# Altium schematic sheet p3_intf_conn_pwr.SchDoc
size OrCAD B; DocumentNumber: 3; SheetNumber: 3; SheetTotal: 3
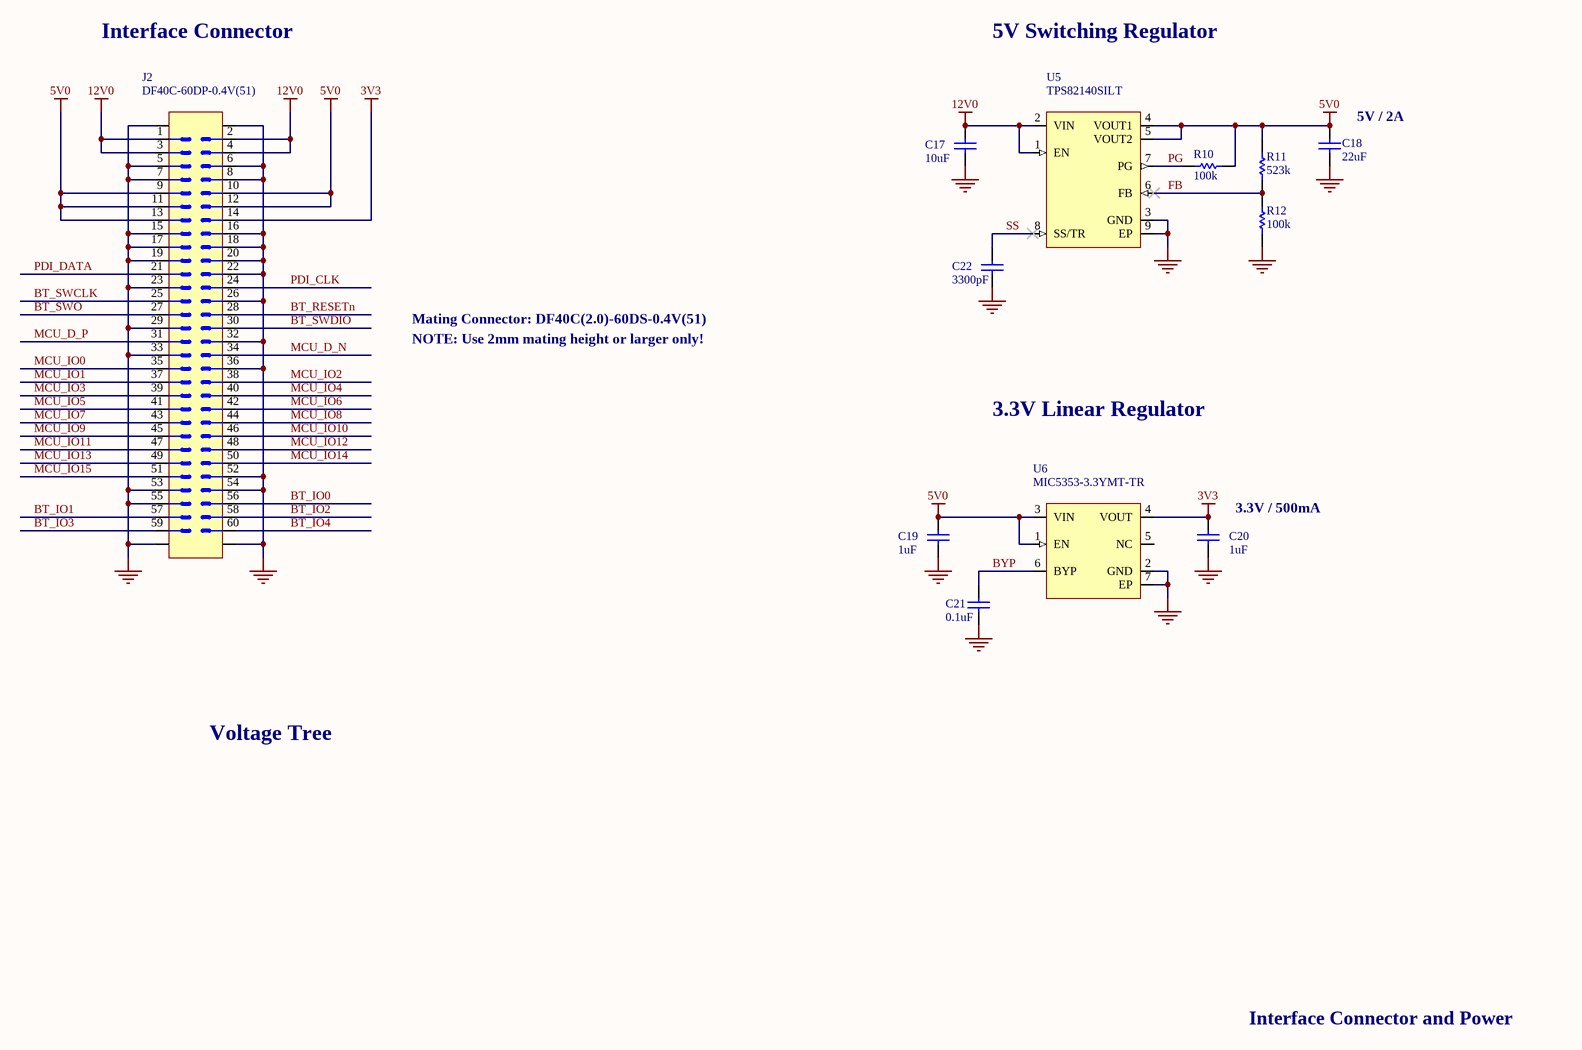
[diagram p0: p3_intf_conn_pwr.SchDoc]

## Parts
C17  10uF  [C0603]
C18  22uF  [C0603]
C19  1uF  [C0402]
C20  1uF  [C0402]
C21  0.1uF  [C0201]
C22  3300pF  [C0201]
J2  DF40C-60DP-0.4V(51)  [HRS_DF40C_60P_PLG]
R10  100k  [R0201]
R11  523k  [R0201]
R12  100k  [R0201]
U5  TPS82140SILT  [TI_USIL8_SIL0008D]
U6  MIC5353-3.3YMT-TR  [MCP_MLF6_MT]

## Nets
3V3: C20.2 J2.14 U6.4(VOUT)
5V0: C18.2 C19.2 J2.9 J2.10 J2.11 J2.12 J2.13 R10.2 R11.2 U5.4(VOUT1) U5.5(VOUT2) U6.1(EN) U6.3(VIN)
12V0: C17.2 J2.1 J2.2 J2.3 J2.4 U5.1(EN) U5.2(VIN)
GND: C17.1 C18.1 C19.1 C20.1 C21.1 C22.1 J2.5 J2.6 J2.7 J2.8 J2.15 J2.16 J2.17 J2.18 J2.19 J2.20 J2.22 J2.23 J2.26 J2.29 J2.32 J2.33 J2.36 J2.52 J2.53 J2.54 J2.55 J2.61 J2.62 J2.63 J2.64 R12.1 U5.3(GND) U5.9(EP) U6.2(GND) U6.7(EP)
BT_IO0: J2.56
BT_IO1: J2.57
BT_IO2: J2.58
BT_IO3: J2.59
BT_IO4: J2.60
BT_RESETn: J2.28
BT_SWCLK: J2.25
BT_SWDIO: J2.30
BT_SWO: J2.27
BYP: C21.2 U6.6(BYP)
FB: R11.1 R12.2 U5.6(FB)
MCU_D_N: J2.34
MCU_D_P: J2.31
MCU_IO0: J2.35
MCU_IO1: J2.37
MCU_IO2: J2.38
MCU_IO3: J2.39
MCU_IO4: J2.40
MCU_IO5: J2.41
MCU_IO6: J2.42
MCU_IO7: J2.43
MCU_IO8: J2.44
MCU_IO9: J2.45
MCU_IO10: J2.46
MCU_IO11: J2.47
MCU_IO12: J2.48
MCU_IO13: J2.49
MCU_IO14: J2.50
MCU_IO15: J2.51
PDI_CLK: J2.24
PDI_DATA: J2.21
PG: R10.1 U5.7(PG)
SS: C22.2 U5.8(SS/TR)

Not connected (* = marked no-connect by the designer): U6 5(NC)

## Notes on the sheet
- Interface Connector
- 5V Switching Regulator
- (near C18) 5V / 2A
- Mating Connector: DF40C(2.0)-60DS-0.4V(51)
- NOTE: Use 2mm mating height or larger only!
- 3.3V Linear Regulator
- (near C20) 3.3V / 500mA
- Voltage Tree
- Interface Connector and Power

## Library data of the parts
C17 = 10uF 25V 0603: CAP CER 10UF 25V X5R 0603; Manufacturer: Murata; Manufacturer Part Number: GRM188R61E106MA73D; Tolerance: 20%; Supplier 1: Digi-Key; Stock 1: 1088965; Pricing 1: 1=0.41, 10=0.285, 100=0.1708, 500=0.1281, 1000=0.1082 (USD); Mount: Surface Mount; Case/Package: 0603; Number of Pins: 2; Weight: 0.000222oz; Case Code (Metric): 1608; Case Code (Imperial): 0603; Min Operating Temperature: -55°C; Max Operating Temperature: 85°C; Voltage Rating: 25V; Capacitance: 10uF; Packaging: Tape and Reel; Package Quantity: 1; Dielectric: X5R; Voltage: 25V; Termination: SMD/SMT; Composition: Ceramic; Voltage Rating (DC): 25V; Length: 1.6mm; Height: 0.8mm; Width: 0.031inch; Thickness: 0.031inch; Depth: 0.8mm; REACH SVHC: No SVHC; Lead Free: Lead Free; ComponentLink1URL: https://datasheet.ciiva.com/22619/c02e-22619674.pdf; ComponentLink1Description: https://datasheet.ciiva.com/22619/c02e-22619674.pdf; ComponentLink2URL: https://datasheet.ciiva.com/22776/608985-22776426.pdf; ComponentLink2Description: https://datasheet.ciiva.com/22776/608985-22776426.pdf; ComponentLink3URL: https://datasheet.ciiva.com/22776/c02e-22776427.pdf; ComponentLink3Description: https://datasheet.ciiva.com/22776/c02e-22776427.pdf; ComponentLink4URL: https://datasheet.ciiva.com/14906/partnumbering-e-01-14906429.pdf; ComponentLink4Description: https://datasheet.ciiva.com/14906/partnumbering-e-01-14906429.pdf; ComponentLink5URL: https://datasheet.ciiva.com/14906/partnumbering-e-01-14906431.pdf; ComponentLink5Description: https://datasheet.ciiva.com/14906/partnumbering-e-01-14906431.pdf; Supplier Part Number 1: 490-7202-1-ND
C18 = 22uF 16V 0603: CAP CER 22UF 16V X5R 0603; Manufacturer: Samsung; Manufacturer Part Number: CL10A226MO7JZNC; Supplier 1: Digi-Key; Stock 1: 0; Supplier Part Number 1: 1276-7076-1-ND
C19 C20 = 1uF 25V 0402: CAP CER 1UF 25V X5R 0402; Manufacturer: Taiyo Yuden; Manufacturer Part Number: TMK105BJ105MV-F; Tolerance: 20%; Supplier 1: Digi-Key; Stock 1: 113342; Pricing 1: 1=0.2, 10=0.14, 100=0.066, 500=0.0463, 1000=0.0383, 2500=0.0357, 5000=0.0326 (USD); Mount: Surface Mount; Case/Package: 0402; Case Code (Metric): 1005; Case Code (Imperial): 0402; Min Operating Temperature: -55°C; Max Operating Temperature: 85°C; Packaging: Tape and Reel; Package Quantity: 1; Voltage Rating (DC): 25V; Dielectric: X5R; Termination: SMD/SMT; Capacitance: 1uF; Voltage Rating: 25V; Composition: Ceramic; Length: 1mm; Height: 0.5mm; Width: 0.02inch; Thickness: 0.022inch; Depth: 0.5mm; Radiation Hardening: No; Halogen Free: Halogen Free; ComponentLink1URL: https://datasheet.ciiva.com/11596/tmk105bj105mv-f-ss-11596466.pdf; ComponentLink1Description: https://datasheet.ciiva.com/11596/tmk105bj105mv-f-ss-11596466.pdf; ComponentLink2URL: https://datasheet.ciiva.com/15922/tmk105bj105mv-f-pdf-15922317.pdf; ComponentLink2Description: https://datasheet.ciiva.com/15922/tmk105bj105mv-f-pdf-15922317.pdf; ComponentLink3URL: https://datasheet.ciiva.com/13404/mlcc-all-e-541559-13404206.pdf; ComponentLink3Description: https://datasheet.ciiva.com/13404/mlcc-all-e-541559-13404206.pdf; ComponentLink4URL: https://datasheet.ciiva.com/30154/128tmk105bj105mv-f-30154639.pdf; ComponentLink4Description: https://datasheet.ciiva.com/30154/128tmk105bj105mv-f-30154639.pdf; Supplier Part Number 1: 587-3245-1-ND
C21 = 0.1uF 16V 0201: CAP CER 0.1UF 16V X5R 0201; Manufacturer: Murata; Manufacturer Part Number: GRM033R61C104ME84D; Capacitance: 1E-07f; Tolerance: 20%; Supplier 1: Digi-Key; Stock 1: 660567; Pricing 1: 1=0.1, 10=0.029, 100=0.013, 500=0.0093, 1000=0.0073, 2500=0.0067, 5000=0.0061 (USD); Case/Package: 0201; Weight: 1.2E-05oz; Case Code (Metric): 0603; Case Code (Imperial): 0201; Min Operating Temperature: -55°C; Max Operating Temperature: 85°C; Packaging: Tape and Reel; Voltage Rating: 16V; Dielectric: X5R; Termination: SMD/SMT; Voltage Rating (DC): 16V; Package Quantity: 15000; Length: 0.024inch; Height: 0.3mm; Width: 0.3mm; Thickness: 0.013inch; ComponentLink1URL: http://www.mouser.com/ds/2/281/c02e-2905.pdf; ComponentLink1Description: http://www.mouser.com/ds/2/281/c02e-2905.pdf; Supplier Part Number 1: 490-9986-1-ND
C22 = 3300pF 16V 0201: CAP CER 3300PF 16V X7R 0201; Manufacturer: Murata; Manufacturer Part Number: GRM033R71C332KA88D; Material: Ceramic; Capacitance: 3.3nF; Tolerance: 10%; Supplier 1: Digi-Key; Stock 1: 49387; Pricing 1: 1=0.1, 10=0.029, 100=0.013, 500=0.0093, 1000=0.0073, 2500=0.0067, 5000=0.0061 (USD); Mount: Surface Mount; Case/Package: 0201; Case Code (Metric): 0603; Case Code (Imperial): 0201; Min Operating Temperature: -55°C; Max Operating Temperature: 125°C; Packaging: Tape and Reel; Package Quantity: 1; Voltage Rating: 16V; Voltage Rating (DC): 16V; Dielectric: X7R; Termination: SMD/SMT; Length: 0.6mm; Height: 0.3mm; Width: 0.012inch; Thickness: 0.013inch; Depth: 0.3mm; Radiation Hardening: No; Lead Free: Lead Free; ComponentLink1URL: https://datasheet.ciiva.com/11620/product-11620449.pdf; ComponentLink1Description: https://datasheet.ciiva.com/11620/product-11620449.pdf; ComponentLink2URL: https://datasheet.ciiva.com/129/grm033r71c332ka88-01-129900.pdf; ComponentLink2Description: https://datasheet.ciiva.com/129/grm033r71c332ka88-01-129900.pdf; ComponentLink3URL: https://datasheet.ciiva.com/129/grm033r71c332ka88-01-129901.pdf; ComponentLink3Description: https://datasheet.ciiva.com/129/grm033r71c332ka88-01-129901.pdf; ComponentLink4URL: https://datasheet.ciiva.com/18184/getdatasheetpartid-467171-18184093.pdf; ComponentLink4Description: https://datasheet.ciiva.com/18184/getdatasheetpartid-467171-18184093.pdf; ComponentLink5URL: https://datasheet.ciiva.com/129/grm033r71c332ka88-01-129902.pdf; ComponentLink5Description: https://datasheet.ciiva.com/129/grm033r71c332ka88-01-129902.pdf; ComponentLink6URL: https://datasheet.ciiva.com/29199/455779-da-01-en-vs-kondensator-0201-29199166.pdf; ComponentLink6Description: https://datasheet.ciiva.com/29199/455779-da-01-en-vs-kondensator-0201-29199166.pdf; Supplier Part Number 1: 490-3191-1-ND
J2 = 60P 0.4mm Hirose Conn Plug: CONN HDR 60POS 0.4MM SMD GOLD; Manufacturer: Hirose; Connector Type: Plug; Number of Contacts: 60; Voltage Rating: 30V; Current Rating: 300mA; Gender: Male; Stack Height: 3.5mm; Supplier 1: Digi-Key; Manufacturer Part Number: DF40C-60DP-0.4V(51); Stock 1: 18849; Pricing 1: 1=1.24, 10=1.094, 25=1.0296, 50=0.9868, 100=0.9438, 250=0.858, 500=0.7722, 1000=0.6864, 2500=0.6221 (USD); Mount: Surface Mount; Case/Package: SMD/SMT; Contact Material: Bronze; Contact Plating: Gold; Housing Material: Polymer; Termination: SMD/SMT; Package Quantity: 5000; Number of Rows: 2; Packaging: Tape and Reel; Number of Positions: 60; Pitch: 0.4mm; REACH SVHC: No SVHC; Lead Free: Lead Free; ComponentLink1URL: https://datasheet.ciiva.com/46408/1824826-46408908.pdf; ComponentLink1Description: https://datasheet.ciiva.com/46408/1824826-46408908.pdf; Supplier Part Number 1: H11628CT-ND
R10 R12 = 100k 0201: RES SMD 100K OHM 1% 1/20W 0201; Manufacturer: Panasonic ECG; Manufacturer Part Number: ERJ-1GEF1003C; Resistance: 100KR; Power Rating: 50mW; Voltage Rating: 25V; Temperature Coefficient: 200ppm/°C; Voltage Rating (DC): 15V; Supplier 1: Digi-Key; Stock 1: 4025669; Pricing 1: 1=0.1, 10=0.059, 100=0.024, 1000=0.0108, 2500=0.0094, 5000=0.0077 (USD); Mount: Surface Mount; Case/Package: 0201; Case Code (Metric): 0603; Case Code (Imperial): 0201; Contact Plating: Tin; Min Operating Temperature: -55°C; Max Operating Temperature: 125°C; Tolerance: 1%; Packaging: Tape and Reel; Package Quantity: 1; Composition: Thick Film; Number of Terminations: 2; Termination: SMD/SMT; Military Standard: Not; Max Power Dissipation: 50mW; Length: 0.6mm; Height: 0.01inch; Width: 0.012inch; Depth: 0.3mm; Radiation Hardening: No; REACH SVHC: Unknown; Lead Free: Lead Free; ComponentLink1URL: https://datasheet.ciiva.com/2439/erj-g-r-e-rev08-2439265.pdf; ComponentLink1Description: https://datasheet.ciiva.com/2439/erj-g-r-e-rev08-2439265.pdf; ComponentLink2URL: https://datasheet.ciiva.com/2439/erj-g-r-e-rev08-2439266.pdf; ComponentLink2Description: https://datasheet.ciiva.com/2439/erj-g-r-e-rev08-2439266.pdf; ComponentLink3URL: https://datasheet.ciiva.com/2439/erj-g-r-e-rev08-2439267.pdf; ComponentLink3Description: https://datasheet.ciiva.com/2439/erj-g-r-e-rev08-2439267.pdf; ComponentLink4URL: https://datasheet.ciiva.com/7830/1678796-7830953.pdf; ComponentLink4Description: https://datasheet.ciiva.com/7830/1678796-7830953.pdf; ComponentLink5URL: https://datasheet.ciiva.com/16205/erj-1gef1003c-16205689.pdf; ComponentLink5Description: https://datasheet.ciiva.com/16205/erj-1gef1003c-16205689.pdf; ComponentLink6URL: https://datasheet.ciiva.com/16782/70260683-16782969.pdf; ComponentLink6Description: https://datasheet.ciiva.com/16782/70260683-16782969.pdf; ComponentLink7URL: https://datasheet.ciiva.com/28514/1694929-28514010.pdf; ComponentLink7Description: https://datasheet.ciiva.com/28514/1694929-28514010.pdf; ComponentLink8URL: https://datasheet.ciiva.com/30087/aoa0000ce2-30087131.pdf; ComponentLink8Description: https://datasheet.ciiva.com/30087/aoa0000ce2-30087131.pdf; Supplier Part Number 1: P100KABCT-ND
R11 = 523k 0201: RES SMD 523K OHM 1% 1/20W 0201; Manufacturer: Panasonic ECG; Manufacturer Part Number: ERJ-1GEF5233C; Resistance: 523KR; Power Rating: 50mW; Voltage Rating: 25V; Temperature Coefficient: 200ppm/°C; Voltage Rating (DC): 15V; Supplier 1: Digi-Key; Stock 1: 42844; Pricing 1: 1=0.1, 10=0.059, 100=0.024, 1000=0.0108, 2500=0.0094, 5000=0.0077 (USD); Mount: Surface Mount; Case/Package: 0201; Case Code (Metric): 0603; Case Code (Imperial): 0201; Contact Plating: Tin; Min Operating Temperature: -55°C; Max Operating Temperature: 125°C; Tolerance: 1%; Packaging: Tape and Reel; Package Quantity: 1; Composition: Thick Film; Number of Terminations: 2; Max Power Dissipation: 50mW; Length: 0.024inch; Height: 0.01inch; Width: 0.012inch; Lead Free: Lead Free; ComponentLink1URL: https://datasheet.ciiva.com/2440/erj-g-r-e-rev08-2440225.pdf; ComponentLink1Description: https://datasheet.ciiva.com/2440/erj-g-r-e-rev08-2440225.pdf; ComponentLink2URL: https://datasheet.ciiva.com/2440/erj-g-r-e-rev08-2440226.pdf; ComponentLink2Description: https://datasheet.ciiva.com/2440/erj-g-r-e-rev08-2440226.pdf; ComponentLink3URL: https://datasheet.ciiva.com/2440/erj-g-r-e-rev08-2440227.pdf; ComponentLink3Description: https://datasheet.ciiva.com/2440/erj-g-r-e-rev08-2440227.pdf; Supplier Part Number 1: P523KABCT-ND
U5 = TPS82140SILT: STEP-DOWN CONVERTER MICROSIP; Manufacturer: Texas Instruments; Supplier 1: Digi-Key; Manufacturer Part Number: TPS82140SILT; Stock 1: 0; Min Operating Temperature: -40°C; Max Operating Temperature: 125°C; Supplier Part Number 1: 296-47089-1-ND
U6 = MIC5353-3.3YMT-TR: IC REG LINEAR 3.3V 500MA 6TMLF; Manufacturer: Microchip; Dropout Voltage: 160mV; Number of Regulators: 1; Min Current Limit: 600mA; Min Input Voltage: 2.6V; Max Input Voltage: 6V; Supplier 1: Digi-Key; Manufacturer Part Number: MIC5353-3.3YMT-TR; Stock 1: 24501; Pricing 1: 1=0.36, 25=0.294, 100=0.273 (USD); Number of Pins: 6; Min Operating Temperature: -40°C; Max Operating Temperature: 125°C; Packaging: Cut Tape; Output Voltage: 3.3V; Output Current: 500mA; Nominal Output Voltage: 3.3V; REACH SVHC: No SVHC; Lead Free: Lead Free; ComponentLink1URL: http://www.farnell.com/datasheets/1692673.pdf; ComponentLink1Description: http://www.farnell.com/datasheets/1692673.pdf; Supplier Part Number 1: 576-3680-1-ND